# Altium schematic sheet LpGBT-Elinks-Master.SchDoc: Master E-Links
size A; DocumentNumber: 10; SheetNumber: 12; SheetTotal: 21
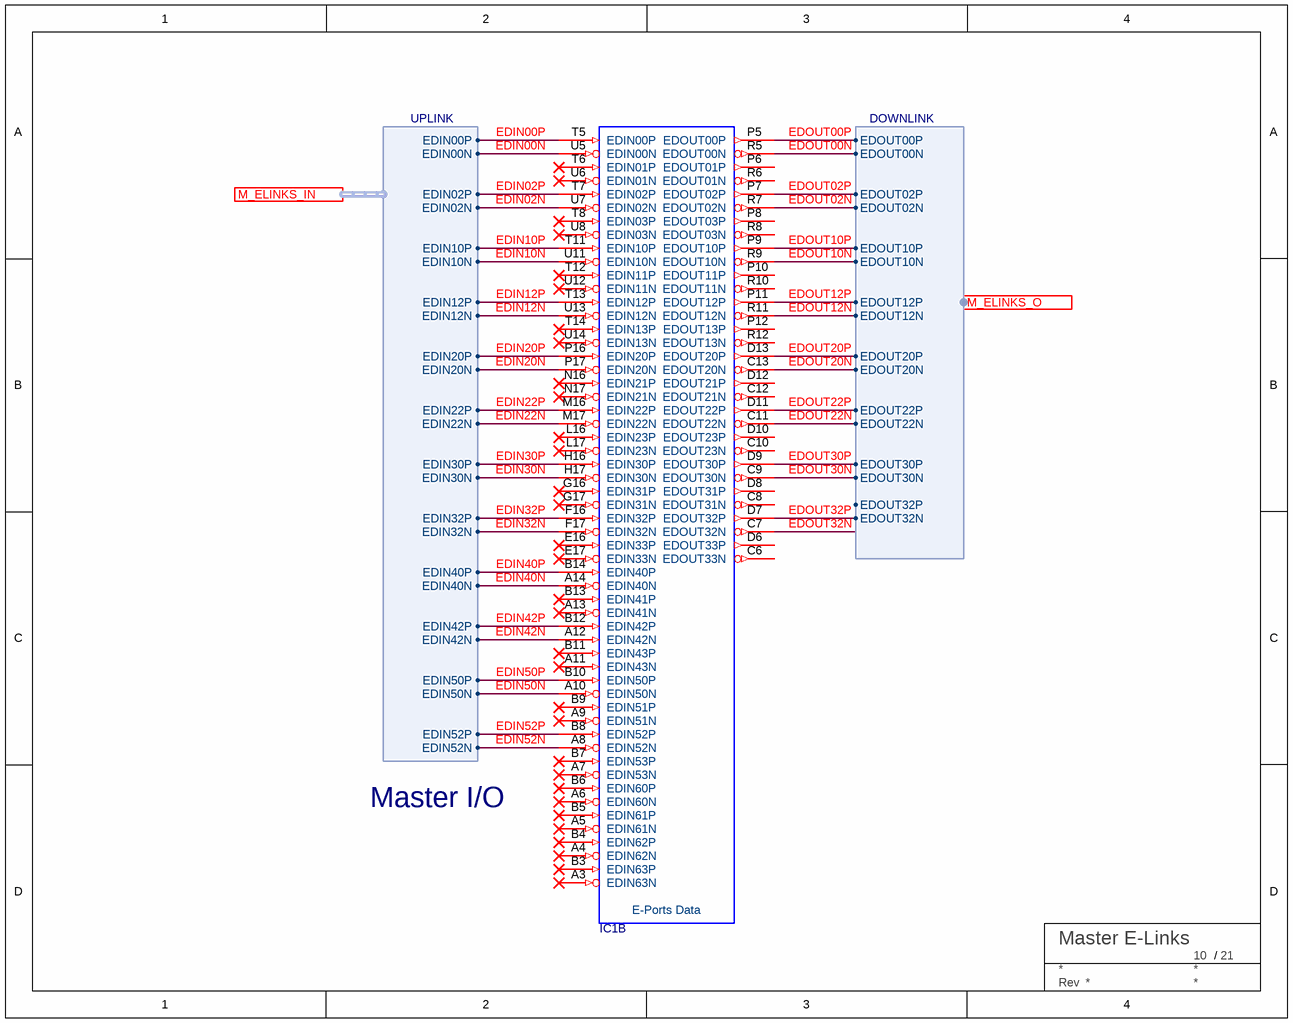
[diagram p0: LpGBT-Elinks-Master.SchDoc]

## Parts
IC1  LPGBT  [BGA289X17]  (value not drawn)  (part B of 8)
TBLOCK?  BU Title block  (value not drawn)  (graphical)

## Ports
M_ELINKS_IN (harness UPLINK), M_ELINKS_O (harness DOWNLINK)

## Harnesses
UPLINK: EDIN00P, EDIN00N, EDIN02P, EDIN02N, EDIN10P, EDIN10N, EDIN12P, EDIN12N, EDIN20P, EDIN20N, EDIN22P, EDIN22N, EDIN30P, EDIN30N, EDIN32P, EDIN32N, EDIN40P, EDIN42P, EDIN50P, EDIN52P, EDIN52N, EDIN50N, EDIN42N, EDIN40N
DOWNLINK: EDOUT30N, EDOUT30P, EDOUT22N, EDOUT22P, EDOUT20N, EDOUT20P, EDOUT12N, EDOUT10N, EDOUT02N, EDOUT00N, EDOUT00P, EDOUT02P, EDOUT10P, EDOUT12P, EDOUT32N, EDOUT32P

## Nets
EDIN00N: IC1.U5(EDIN00N) ; port M_ELINKS_IN.EDIN00N
EDIN00P: IC1.T5(EDIN00P) ; port M_ELINKS_IN.EDIN00P
EDIN02N: IC1.U7(EDIN02N) ; port M_ELINKS_IN.EDIN02N
EDIN02P: IC1.T7(EDIN02P) ; port M_ELINKS_IN.EDIN02P
EDIN10N: IC1.U11(EDIN10N) ; port M_ELINKS_IN.EDIN10N
EDIN10P: IC1.T11(EDIN10P) ; port M_ELINKS_IN.EDIN10P
EDIN12N: IC1.U13(EDIN12N) ; port M_ELINKS_IN.EDIN12N
EDIN12P: IC1.T13(EDIN12P) ; port M_ELINKS_IN.EDIN12P
EDIN20N: IC1.P17(EDIN20N) ; port M_ELINKS_IN.EDIN20N
EDIN20P: IC1.P16(EDIN20P) ; port M_ELINKS_IN.EDIN20P
EDIN22N: IC1.M17(EDIN22N) ; port M_ELINKS_IN.EDIN22N
EDIN22P: IC1.M16(EDIN22P) ; port M_ELINKS_IN.EDIN22P
EDIN30N: IC1.H17(EDIN30N) ; port M_ELINKS_IN.EDIN30N
EDIN30P: IC1.H16(EDIN30P) ; port M_ELINKS_IN.EDIN30P
EDIN32N: IC1.F17(EDIN32N) ; port M_ELINKS_IN.EDIN32N
EDIN32P: IC1.F16(EDIN32P) ; port M_ELINKS_IN.EDIN32P
EDIN40N: IC1.A14(EDIN40N) ; port M_ELINKS_IN.EDIN40N
EDIN40P: IC1.B14(EDIN40P) ; port M_ELINKS_IN.EDIN40P
EDIN42N: IC1.A12(EDIN42N) ; port M_ELINKS_IN.EDIN42N
EDIN42P: IC1.B12(EDIN42P) ; port M_ELINKS_IN.EDIN42P
EDIN50N: IC1.A10(EDIN50N) ; port M_ELINKS_IN.EDIN50N
EDIN50P: IC1.B10(EDIN50P) ; port M_ELINKS_IN.EDIN50P
EDIN52N: IC1.A8(EDIN52N) ; port M_ELINKS_IN.EDIN52N
EDIN52P: IC1.B8(EDIN52P) ; port M_ELINKS_IN.EDIN52P
EDOUT00N: IC1.R5(EDOUT00N) ; port M_ELINKS_O.EDOUT00N
EDOUT00P: IC1.P5(EDOUT00P) ; port M_ELINKS_O.EDOUT00P
EDOUT02N: IC1.R7(EDOUT02N) ; port M_ELINKS_O.EDOUT02N
EDOUT02P: IC1.P7(EDOUT02P) ; port M_ELINKS_O.EDOUT02P
EDOUT10N: IC1.R9(EDOUT10N) ; port M_ELINKS_O.EDOUT10N
EDOUT10P: IC1.P9(EDOUT10P) ; port M_ELINKS_O.EDOUT10P
EDOUT12N: IC1.R11(EDOUT12N) ; port M_ELINKS_O.EDOUT12N
EDOUT12P: IC1.P11(EDOUT12P) ; port M_ELINKS_O.EDOUT12P
EDOUT20N: IC1.C13(EDOUT20N) ; port M_ELINKS_O.EDOUT20N
EDOUT20P: IC1.D13(EDOUT20P) ; port M_ELINKS_O.EDOUT20P
EDOUT22N: IC1.C11(EDOUT22N) ; port M_ELINKS_O.EDOUT22N
EDOUT22P: IC1.D11(EDOUT22P) ; port M_ELINKS_O.EDOUT22P
EDOUT30N: IC1.C9(EDOUT30N) ; port M_ELINKS_O.EDOUT30N
EDOUT30P: IC1.D9(EDOUT30P) ; port M_ELINKS_O.EDOUT30P
EDOUT32N: IC1.C7(EDOUT32N)
EDOUT32P: IC1.D7(EDOUT32P) ; port M_ELINKS_O.EDOUT32N

Not connected (* = marked no-connect by the designer): IC1 A3(EDIN63N)* A4(EDIN62N)* A5(EDIN61N)* A6(EDIN60N)* A7(EDIN53N)* A9(EDIN51N)* A11(EDIN43N)* A13(EDIN41N)* B3(EDIN63P)* B4(EDIN62P)* B5(EDIN61P)* B6(EDIN60P)* B7(EDIN53P)* B9(EDIN51P)* B11(EDIN43P)* B13(EDIN41P)* C6(EDOUT33N) C8(EDOUT31N) C10(EDOUT23N) C12(EDOUT21N) D6(EDOUT33P) D8(EDOUT31P) D10(EDOUT23P) D12(EDOUT21P) E16(EDIN33P)* E17(EDIN33N)* G16(EDIN31P)* G17(EDIN31N)* L16(EDIN23P)* L17(EDIN23N)* N16(EDIN21P)* N17(EDIN21N)* P6(EDOUT01P) P8(EDOUT03P) P10(EDOUT11P) P12(EDOUT13P) R6(EDOUT01N) R8(EDOUT03N) R10(EDOUT11N) R12(EDOUT13N) T6(EDIN01P)* T8(EDIN03P)* T12(EDIN11P)* T14(EDIN13P)* U6(EDIN01N)* U8(EDIN03N)* U12(EDIN11N)* U14(EDIN13N)*

## Notes on the sheet
- Master I/O
- (in symbol LPGBT, part B) E-Ports Data
- (in symbol TITLE_BLOCK_BU) /; Rev

## Library data of the parts
IC1 = LPGBT: Low Power Gigabit Transceiver; Manufacturer: CERN; Pinout Version: 180226; Bonding: No; Device: LPGBT; Manufacturer Part Number: LPGBT; SMD: Yes; Mounted: Yes; LatestRevisionDate: 26.10.2018; PackageDescription: BGA, 289-Leads, Body 9.00x9.00mmx1.28mm, Pitch 0.50mm; Part Description: Low Power Gigabit Transceiver; Case: BGA289; Part Number: LPGBT; Pin Count: 289; Socket: No; Component Kind: Standard; Component Type: Standard; Footprint: BGA289C50P17X17_900X900X128
TBLOCK? = TITLE_BLOCK_BU